# Altium project DAM16.PrjPcb
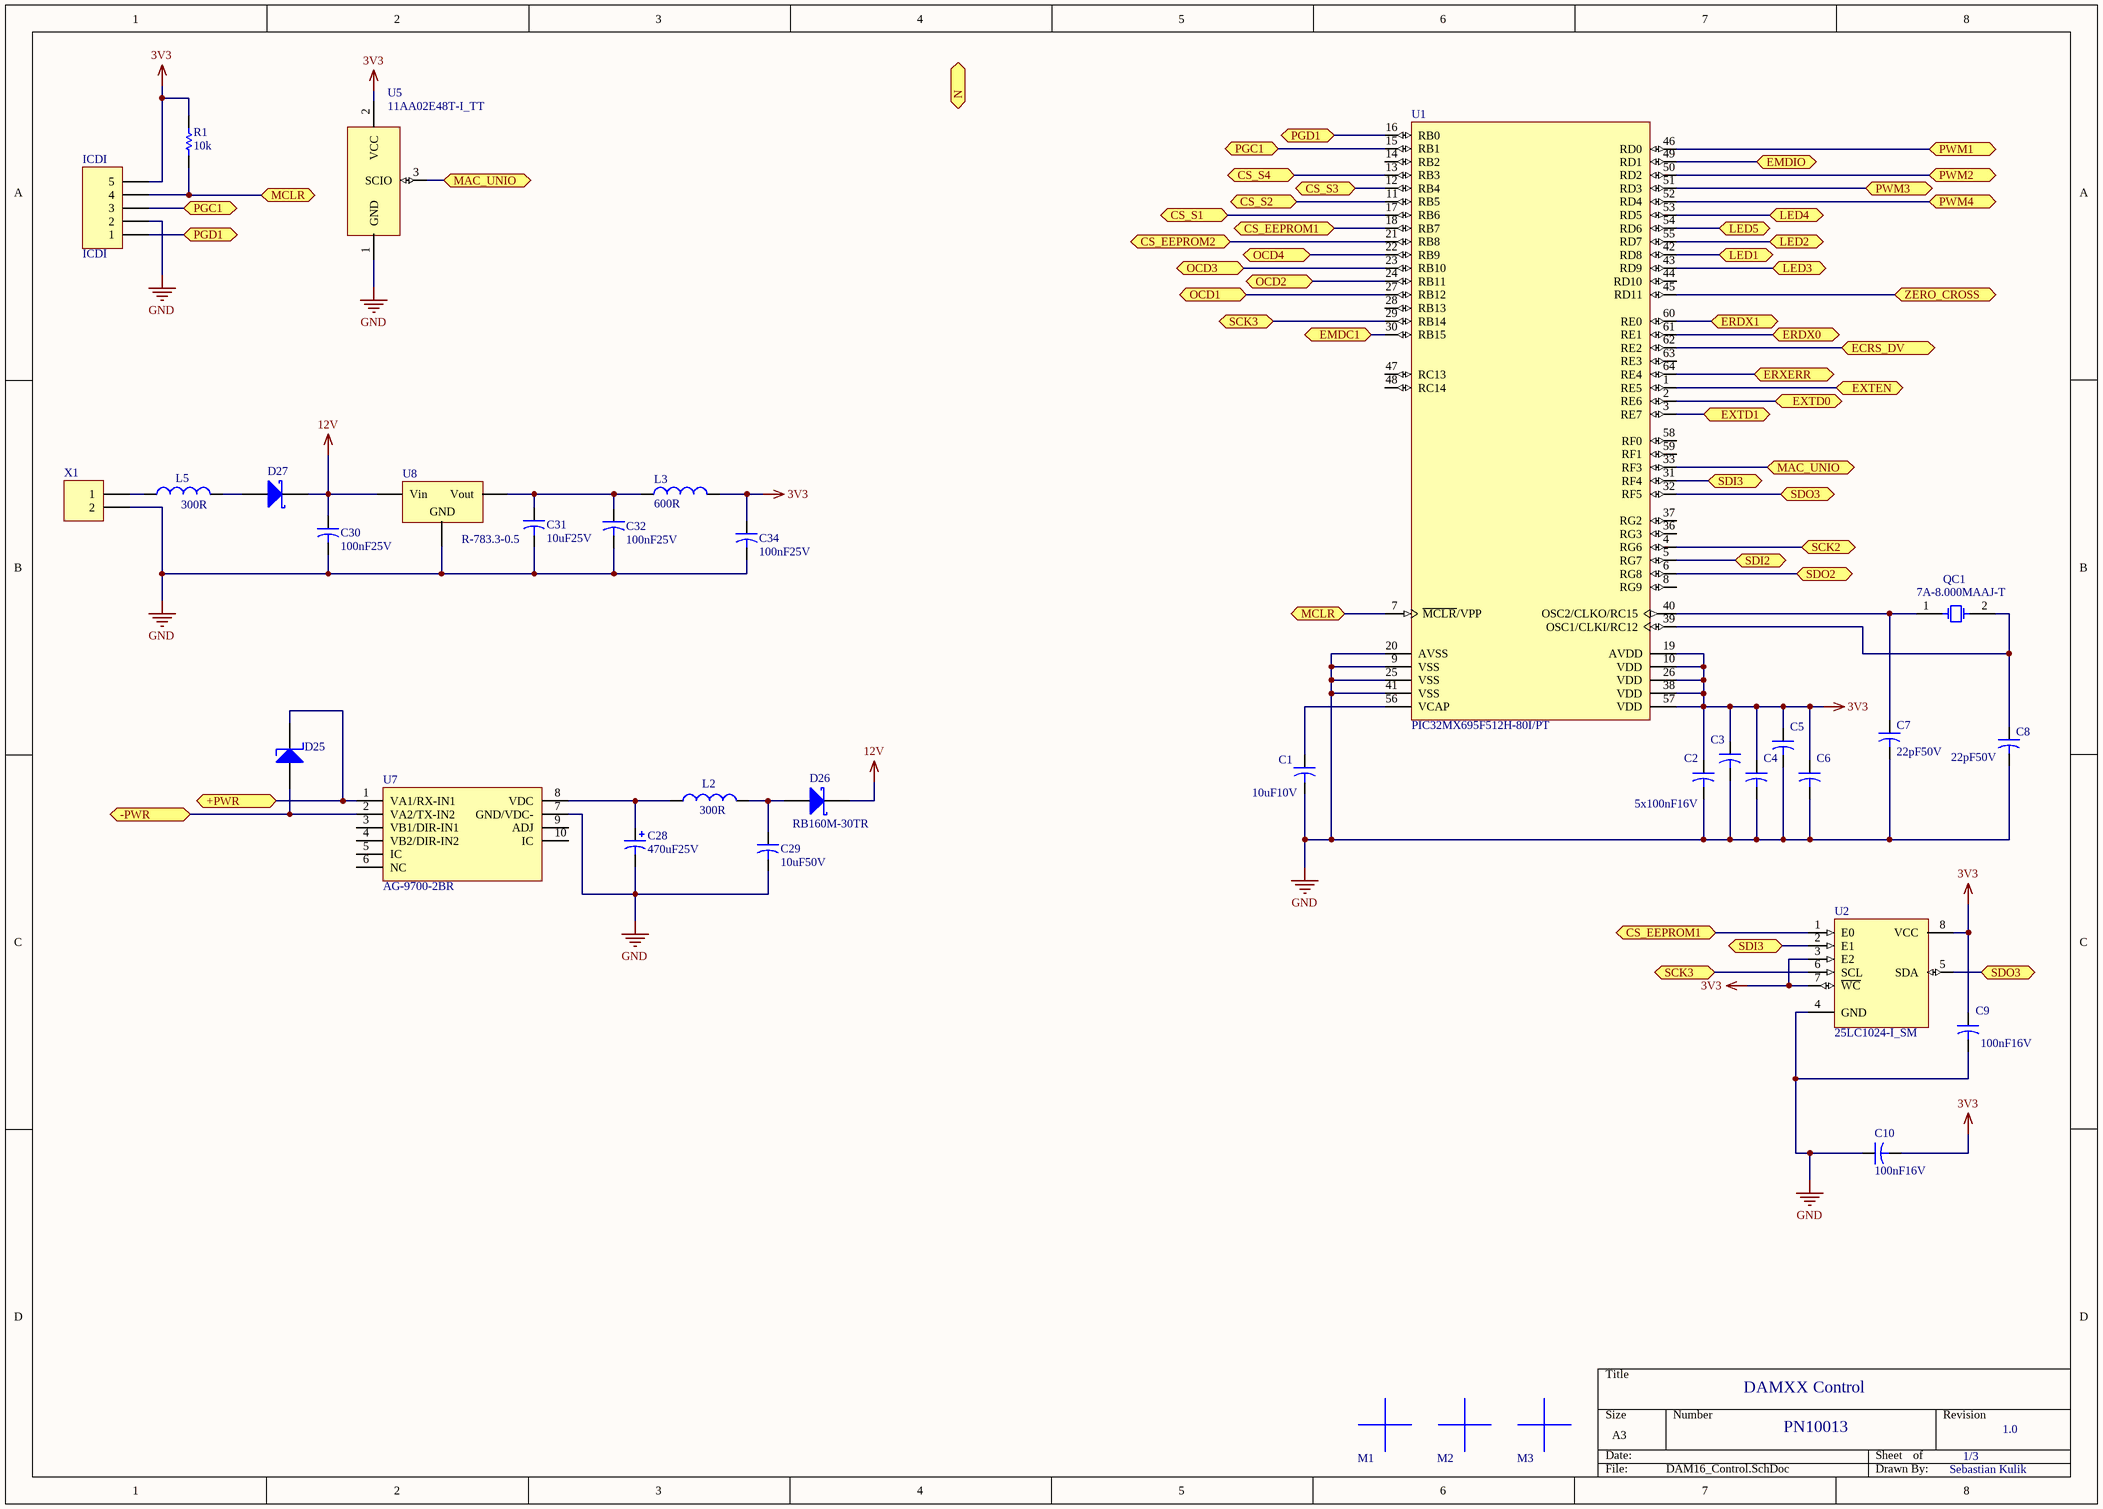
[diagram p0: DAM16_Control.SchDoc]
3 sheets, 96 parts. Net scope: flat (ports and power ports of the same name join across sheets).
Board file: DAM16.PcbDoc
Sheets:
  DAM16_Control.SchDoc
  DAM16_Ethernet.SchDoc
  DAM16_Relays.SchDoc

## Sheet DAM16_Control.SchDoc
size A3

### Parts
C1  value 10uF10V  [C0603]  (hidden comment: 10uF10V_0603)
C2  100nF16V_0402  [C0402]  (value not drawn)
C3  100nF16V_0402  [C0402]  (value not drawn)
C4  100nF16V_0402  [C0402]  (value not drawn)
C5  100nF16V_0402  [C0402]  (value not drawn)
C6  100nF16V_0402  [C0402]  (value not drawn)
C7  value 22pF50V  [C0402]  (hidden comment: 22pF50V_0402)
C8  value 22pF50V  [C0402]  (hidden comment: 22pF50V_0402)
C9  value 100nF16V  [C0402]  (hidden comment: 100nF16V_0402)
C10  value 100nF16V  [C0402]  (hidden comment: 100nF16V_0402)
C28  value 470uF25V  [Panasonic-H13]  (hidden comment: 470uF25V_POL)
C29  value 10uF50V  [C1210]  (hidden comment: 10uF50V_1210)
C30  value 100nF25V  [C0402]  (hidden comment: 100nF25V_0402)
C31  value 10uF25V  [C1210]  (hidden comment: 10uF25V_1210)
C32  value 100nF25V  [C0402]  (hidden comment: 100nF25V_0402)
C34  value 100nF25V  [C0402]  (hidden comment: 100nF25V_0402)
D25  SMAJ58A-E3/61  [DO214A]  (value not drawn)
D26  RB160M-30TR  [SOD123]
D27  SD103AW-V-GS08  [SOD123]  (value not drawn)
ICDI  ICDI  [HDR1X5-1.27]
L2  value 300R  [L0603]  (hidden comment: 300R2A_0603)
L3  value 600R  [P0402]  (hidden comment: 120R1.2A_0402)
L5  value 300R  [L0603]  (hidden comment: 10uF2A)
M1  Mark  [Mark-3mm]  (value not drawn)
M2  Mark  [Mark-3mm]  (value not drawn)
M3  Mark  [Mark-3mm]  (value not drawn)
QC1  7A-8.000MAAJ-T  [TXC_7A]
R1  value 10k  [R0402]  (hidden comment: 10k_0402)
U1  PIC32MX695F512H-80I/PT  [TQFP-64_N1]
U2  25LC1024-I_SM  [SOP8_N]
U5  11AA02E48T-I_TT  [SOT23_M]
U7  AG-9700-2BR  [Ag9700-2BR]
U8  R-783.3-0.5  [R-783_3-0_5]
X1  WR-TBL3127  [WR-TBL-3127]  (value not drawn)

### Ports
+PWR, -PWR, CS_EEPROM1, CS_EEPROM2, CS_S1, CS_S2, CS_S3, CS_S4, ECRS_DV, EMDC1, EMDIO, ERDX0, ERDX1, ERXERR, EXTD0, EXTD1, EXTEN, LED1, LED2, LED3, LED4, LED5, MAC_UNIO, MCLR, N, OCD1, OCD2, OCD3, OCD4, PGC1, PGD1, PWM1, PWM2, PWM3, PWM4, SCK2, SCK3, SDI2, SDI3, SDO2, SDO3, ZERO_CROSS

### Nets
3V3: C2.1 C3.1 C4.1 C5.1 C6.1 C9.1 C10.2 C34.1 ICDI.5 L3.2 R1.2 U1.10(VDD) U1.19(AVDD) U1.26(VDD) U1.38(VDD) U1.57(VDD) U2.3(E2) U2.7(~{WC}) U2.8(VCC) U5.2(VCC)
12V: C30.1 D26.1(K) D27.1(K) U8.1(Vin)
GND: C1.2 C2.2 C3.2 C4.2 C5.2 C6.2 C7.2 C8.2 C9.2 C10.1 C28.2 C29.2 C30.2 C31.2 C32.2 C34.2 ICDI.2 U1.9(VSS) U1.20(AVSS) U1.25(VSS) U1.41(VSS) U2.4(GND) U5.1(GND) U7.7(GND/VDC-) U8.2(GND) X1.2
NetC1_1: C1.1 U1.56(VCAP)
NetC7_1: C7.1 QC1.1(E/D) U1.40(OSC2/CLKO/RC15)
NetC8_1: C8.1 QC1.2(GND) U1.39(OSC1/CLKI/RC12)
NetC28_1: C28.1 L2.1 U7.8(VDC)
NetC29_1: C29.1 D26.2(A) L2.2
NetC31_1: C31.1 C32.1 L3.1 U8.3(Vout)
NetD25_1: D25.1(K) U7.1(VA1/RX-IN1) ; port +PWR
NetD25_2: D25.2(A) U7.2(VA2/TX-IN2) ; port -PWR
NetD27_2: D27.2(A) L5.2
NetICDI_1: ICDI.1 U1.16(RB0) ; port PGD1
NetICDI_3: ICDI.3 U1.15(RB1) ; port PGC1
NetICDI_4: ICDI.4 R1.1 U1.7(~{MCLR}/VPP) ; port MCLR
NetL5_1: L5.1 X1.1
NetR4_1: U1.49(RD1) ; port EMDIO
NetR5_1: U1.60(RE0) ; port ERDX1
NetR6_2: U1.61(RE1) ; port ERDX0
NetR7_2: U1.64(RE4) ; port ERXERR
NetR8_2: U1.62(RE2) ; port ECRS_DV
NetU1_1: U1.1(RE5) ; port EXTEN
NetU1_2: U1.2(RE6) ; port EXTD0
NetU1_3: U1.3(RE7) ; port EXTD1
NetU1_4: U1.4(RG6) ; port SCK2
NetU1_5: U1.5(RG7) ; port SDI2
NetU1_6: U1.6(RG8) ; port SDO2
NetU1_11: U1.11(RB5) ; port CS_S2
NetU1_12: U1.12(RB4) ; port CS_S3
NetU1_13: U1.13(RB3) ; port CS_S4
NetU1_17: U1.17(RB6) ; port CS_S1
NetU1_18: U1.18(RB7) U2.1(E0) ; port CS_EEPROM1
NetU1_21: U1.21(RB8) ; port CS_EEPROM2
NetU1_22: U1.22(RB9) ; port OCD4
NetU1_23: U1.23(RB10) ; port OCD3
NetU1_24: U1.24(RB11) ; port OCD2
NetU1_27: U1.27(RB12) ; port OCD1
NetU1_29: U1.29(RB14) U2.6(SCL) ; port SCK3
NetU1_30: U1.30(RB15) ; port EMDC1
NetU1_31: U1.31(RF4) U2.2(E1) ; port SDI3
NetU1_32: U1.32(RF5) U2.5(SDA) ; port SDO3
NetU1_33: U1.33(RF3) U5.3(SCIO) ; port MAC_UNIO
NetU1_42: U1.42(RD8) ; port LED1
NetU1_43: U1.43(RD9) ; port LED3
NetU1_45: U1.45(RD11) ; port ZERO_CROSS
NetU1_46: U1.46(RD0) ; port PWM1
NetU1_50: U1.50(RD2) ; port PWM2
NetU1_51: U1.51(RD3) ; port PWM3
NetU1_52: U1.52(RD4) ; port PWM4
NetU1_53: U1.53(RD5) ; port LED4
NetU1_54: U1.54(RD6) ; port LED5
NetU1_55: U1.55(RD7) ; port LED2

Not connected (* = marked no-connect by the designer): U1 8(RG9) 14(RB2) 28(RB13) 36(RG3) 37(RG2) 44(RD10) 47(RC13) 48(RC14) 58(RF0) 59(RF1) 63(RE3); U7 3(VB1/DIR-IN1) 4(VB2/DIR-IN2) 5(IC) 6(NC) 9(ADJ) 10(IC)

### Notes on the sheet
- (near C2) 5x100nF16V
- DAMXX Control
- PN10013
- 1/3
- 1.0
- Sebastian Kulik

### Library data of the parts
C1 = 10uF10V_0603: Capacitor; Part Description: AVX ,  X5R, 20%, 10V; Deliverer PartNr: 1867954RL; Manufacturer: AVX; Manufacturer PartNr: 0603ZD106MAT2A; Deliverer: Farnell; TDFE-PN: C0016; Published: 11.02.2014; Publisher: Sebastian Kulik; PackageDescription: C0603
C2-C6 C9 C10 = 100nF16V_0402: Capacitor; Part Description: TDK. CGA series, X7R, 10%, 16V; Deliverer PartNr: 2210748RL; Manufacturer: TDK; Manufacturer PartNr: CGA2B1X7R1C104K050BC; Deliverer: Farnell; TDFE-PN: C0025; Published: 12.02.2014; Publisher: Sebastian Kulik; PackageDescription: C0403
  C2-C6: Value: 100nF16V
C7 C8 = 22pF50V_0402: Murata, GRM series, 50V; Deliverer PartNr: 8819629RL; Manufacturer PartNr: GRM1555C1H220JZ01D; Deliverer: Farnell; TDFE-PN: C0021; Published: 11.02.2014; Part Description: Murata, GRM series, 50V; Publisher: Sebastian Kulik; PackageDescription: C0403; Manufacturer: Murata
C28 = 470uF25V_POL: Panasonic, TG series; Deliverer PartNr: 2282114; Manufacturer PartNr: EEV-TG1E471Q; Deliverer: Farnell; TDFE-PN: C0038; Published: 17.02.2014; Part Description: Panasonic, TG series; Publisher: Sebastian Kulik; Manufacturer: Panasonic
C29 = 10uF50V_1210: AVX,  X7R, 10%, 50V; Deliverer PartNr: 2094047RL; Manufacturer PartNr: 12105C106KAT2A; Deliverer: Farnell; TDFE-PN: C0039; Published: 17.02.2014; Part Description: AVX,  X7R, 10%, 50V; Publisher: Sebastian Kulik; PackageDescription: C1210; Manufacturer: AVX
C30 C32 C34 = 100nF25V_0402: AVX, X5R, 10%, 25V; Deliverer PartNr: 2280767; Manufacturer PartNr: 04023D104KAT2A; Deliverer: Farnell; TDFE-PN: C0036; Published: 13.02.2014; Part Description: AVX, X5R, 10%, 25V; Publisher: Sebastian Kulik; PackageDescription: C0403; Manufacturer: AVX
C31 = 10uF25V_1210: Capacitor; Part Description: TDK  C series, X5R, 10%, 25V; Deliverer PartNr: 2346957; Manufacturer: TDK; Manufacturer PartNr: C3225X5R1E106K250AA; Deliverer: Farnell; TDFE-PN: C0014; Published: 12.02.2014; Publisher: Sebastian Kulik; PackageDescription: C1210
D25 = SMAJ58A-E3/61: TVS, 400W, 58V; Deliverer PartNr: 1837053; Manufacturer: Vishay; TDE-PN: DIS0009; Deliverer: Farnell; Published: 17.02.2014; PackageReference: DO214AC; Publisher: Sebastian Kulik; PackageDescription: DO214AC; Manufacturer PartNr: SMAJ58A-E3/61
D26 = RB160M-30TR: Diode Schottky,2A,40V; Deliverer PartNr: 1525480; Manufacturer: Rohm; TDE-PN: DIS0010; Deliverer: Farnell; Published: 17.02.2014; PackageReference: SOD123; Publisher: Sebastian Kulik; PackageDescription: SOD123; Manufacturer PartNr: RB160M-30TR
D27 = SD103AW-V-GS08: Diode Schottky,2A,40V; Deliverer PartNr: 1617720RL; Manufacturer: Vishay; TDE-PN: DIS0008; Deliverer: Farnell; Published: 12.02.2014; PackageReference: TO-220AC; Publisher: Sebastian Kulik; PackageDescription: SOD123; Manufacturer PartNr: SD103AW-V-GS08
ICDI = ICDI: Header, 5-Pin; LatestRevisionDate: 17-Jul-2002; LatestRevisionNote: Re-released for DXP Platform.; Publisher: Sebastian Kulik
L2 L5 = 300R2A_0603: WE, Ferrit, 300Rx2A; Deliverer PartNr: 1635705; Manufacturer PartNr: 742792641; Deliverer: Farnell; TDE-PN: P0021; Manufacturer: WE; Published: 26.05.2014; Publisher: Sebastian Kulik
L3 = 120R1.2A_0402: Ferrit, 1.2A, 120R@100MHz; Deliverer PartNr: 1961699RL; Manufacturer: WE; Manufacturer PartNr: 7427927311; Deliverer: Farnell; TDE-PN: P0022; Published: 26.05.2014; Publisher: Sebastian Kulik
QC1 = Crystal_8MHz: Crystal, 7A-8.000MAAJ-T; Deliverer PartNr: 1892148; Manufacturer: TXC; Deliverer: Farnell; TDE-PN: P0003; Published: 14.02.2014; PackageReference: 7A; Publisher: Sebastian Kulik; Manufacturer PartNr: 7A-8.000MAAJ-T
R1 = 10k_0402: Vishay CRCW series, 125mW, 1%; Manufacturer PartNr: CRCW040210K0FKEAHP; Deliverer PartNr: 1738864; TDE-PN: R0012; Deliverer: Farnell; Published: 12.02.2014; PackageReference: 0402; Publisher: Sebastian Kulik; PackageDescription: 0402; Manufacturer: Vishay; Part Description: Vishay CRCW series, 125mW, 1%
U1 = PIC32MX695F512H-80I/PT: High Performance ROM-less Microcontroller with External Memory Bus, 1.5K RAM, 64-Pin TQFP, 4.2 to 5.5V Supply Range, Industrial Temperature; Deliverer PartNr: 1778975; Manufacturer: Microchip; Deliverer: Farnell; TDE-PN: IC0031; Published: 11.02.2014; PackageReference: TQFP-64; Publisher: Sebastian Kulik; PackageDescription: 64-Pin Thin Plastic Quad Flat Pack 0.5 mm Pitch, 1.0/0.1 mm Lead Form; Manufacturer PartNr: PIC32MX695F512H-80I/PT
U2 = 25LC1024-I_SM: 1024 Kbit Serial SPI Bus EEPROM; Deliverer PartNr: 1331393; Manufacturer: Microchip; Deliverer: Farnell; TDE-PN: IC0033; Published: 12.02.2014; PackageReference: SOP8; Publisher: Sebastian Kulik; Manufacturer PartNr: 25LC1024-I_SM
U5 = 11AA02E48T-I_TT: 2 kbit Serial  EEPROM; Deliverer PartNr: 1707616RL; Manufacturer PartNr: 11AA02E48T-I/TT; Manufacturer: Microchip; Deliverer: Farnell; TDE-PN: IC0035; Published: 12.02.2014; PackageReference: SOT23; Publisher: Sebastian Kulik
U7 = AG-9700-2BR: PoE, 12V, 12W; Manufacturer: Silvertel; TDE-PN: IC0047; Published: 23.05.2014; Deliverer PartNr: -; Deliverer: -; PackageReference: TSSOP8; Publisher: Sebastian Kulik; Manufacturer PartNr: AG-9700-2BR
U8 = Recom-R-783_3-0_5: Voltage Regulator; Manufacturer: Recom; Deliverer PartNr: 532-8044; TDE-PN: IC0032; Deliverer: RS-Components; Published: 12.02.2014; Manufacturer PartNr: R-783.3-0.5; PackageReference: D2PAK; Publisher: Sebastian Kulik
X1 = Header-2-WR-TBL3127: Header 2 pin, horizontal,WR-TBL3127; Manufacrurer PartNr: 691312710002; Manufacturer: WE; Deliverer PartNr: 1841288; Deliverer: Farnell; TDE-PN: CON0014; LatestRevisionDate: 28.05.2014; LatestRevisionNote: Re-released for DXP Platform.; Publisher: Sebastian Kulik

## Sheet DAM16_Ethernet.SchDoc
size A3
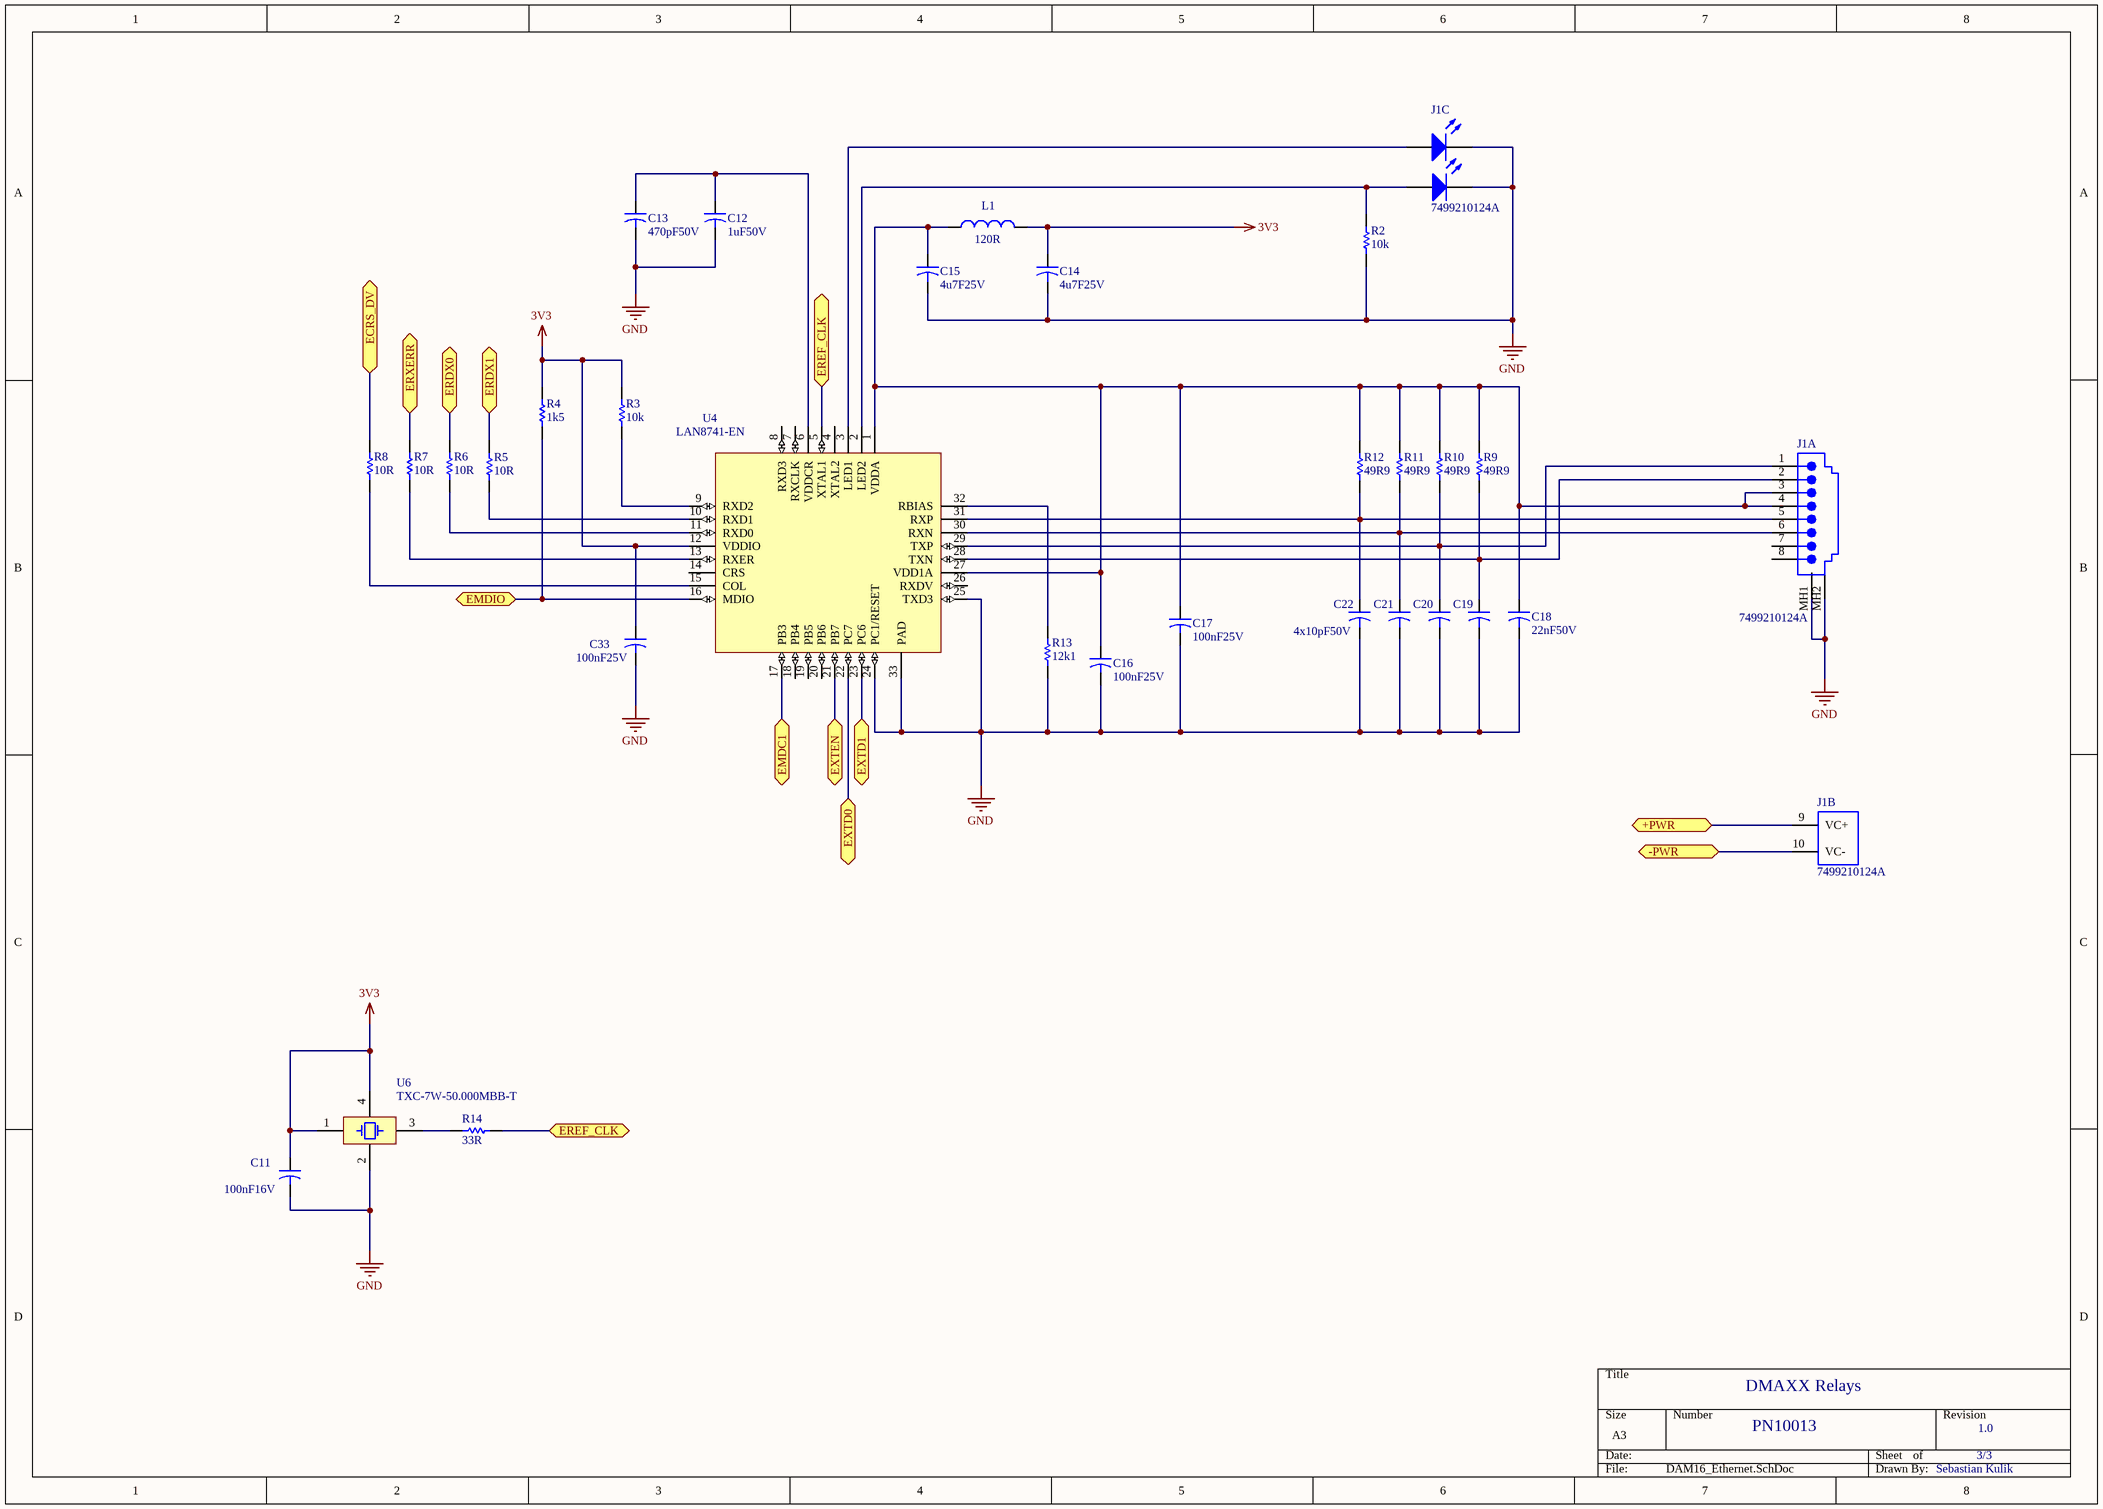
[diagram p1: DAM16_Ethernet.SchDoc]

### Parts
C11  value 100nF16V  [C0402]  (hidden comment: 100nF16V_0402)
C12  value 1uF50V  [C0603]  (hidden comment: 1uF50V_0603)
C13  value 470pF50V  [C0402]  (hidden comment: 470pF50V_0402)
C14  value 4u7F25V  [C0805]  (hidden comment: 4u7F25V_0805)
C15  value 4u7F25V  [C0805]  (hidden comment: 4u7F25V_0805)
C16  value 100nF25V  [C0402]  (hidden comment: 100nF25V_0402)
C17  value 100nF25V  [C0402]  (hidden comment: 100nF25V_0402)
C18  value 22nF50V  [C0603]  (hidden comment: 22nF50V_0603)
C19  10pF50V_0603  [C0603]  (value not drawn)
C20  10pF50V_0603  [C0603]  (value not drawn)
C21  10pF50V_0603  [C0603]  (value not drawn)
C22  10pF50V_0603  [C0603]  (value not drawn)
C33  value 100nF25V  [C0402]  (hidden comment: 100nF25V_0402)
J1  7499210124A  [7499210124A]  (parts A,B,C of 3)
L1  value 120R  [L0603]  (hidden comment: 120R4A_0603)
R2  value 10k  [R0402]  (hidden comment: 10k_0402)
R3  value 10k  [R0402]  (hidden comment: 10k_0402)
R4  value 1k5  [R0402]  (hidden comment: 1k5_0402)
R5  value 10R  [R0402]  (hidden comment: 10R_0402)
R6  value 10R  [R0402]  (hidden comment: 10R_0402)
R7  value 10R  [R0402]  (hidden comment: 10R_0402)
R8  value 10R  [R0402]  (hidden comment: 10R_0402)
R9  value 49R9  [R0402]  (hidden comment: 49R9_0402)
R10  value 49R9  [R0402]  (hidden comment: 49R9_0402)
R11  value 49R9  [R0402]  (hidden comment: 49R9_0402)
R12  value 49R9  [R0402]  (hidden comment: 49R9_0402)
R13  value 12k1  [R0603(1608)]  (hidden comment: 12k1_0603)
R14  value 33R  [R0402]  (hidden comment: 33R_0402)
U4  LAN8741-EN  [32M1-A_M]
U6  TXC-7W-50.000MBB-T  [TXC_7W]

### Ports
+PWR, -PWR, ECRS_DV, EMDC1, EMDIO, ERDX0, ERDX1, EREF_CLK, ERXERR, EXTD0, EXTD1, EXTEN

### Nets
3V3: C11.1 C14.1 C33.1 L1.2 R3.2 R4.2 U4.12(VDDIO) U6.1(E/D) U6.4(VCC)
GND: C11.2 C12.2 C13.2 C14.2 C15.2 C16.2 C17.2 C18.2 C19.2 C20.2 C21.2 C22.2 C33.2 J1.11(K) J1.13(K) J1.MH1(Shield) J1.MH2(Shield) R2.1 R13.1 U4.24(PC1/RESET) U4.25(TXD3) U4.33(PAD) U6.2(GND)
NetC12_1: C12.1 C13.1 U4.6(VDDCR)
NetC15_1: C15.1 C16.1 C17.1 C18.1 J1.3 J1.4 L1.1 R9.2 R10.2 R11.2 R12.2 U4.1(VDDA) U4.27(VDD1A)
NetC19_1: C19.1 J1.2 R9.1 U4.28(TXN)
NetC20_1: C20.1 J1.1 R10.1 U4.29(TXP)
NetC21_1: C21.1 J1.6 R11.1 U4.30(RXN)
NetC22_1: C22.1 J1.5 R12.1 U4.31(RXP)
NetD25_1: J1.9(VC+) ; port +PWR
NetD25_2: J1.10(VC-) ; port -PWR
NetJ1_12: J1.12(A) U4.3(LED1)
NetJ1_14: J1.14(A) R2.2 U4.2(LED2)
NetR3_1: R3.1 U4.9(RXD2)
NetR4_1: R4.1 U4.16(MDIO) ; port EMDIO
NetR5_1: R5.1 ; port ERDX1
NetR5_2: R5.2 U4.10(RXD1)
NetR6_1: R6.1 U4.11(RXD0)
NetR6_2: R6.2 ; port ERDX0
NetR7_1: R7.1 U4.13(RXER)
NetR7_2: R7.2 ; port ERXERR
NetR8_1: R8.1 U4.15(COL)
NetR8_2: R8.2 ; port ECRS_DV
NetR13_2: R13.2 U4.32(RBIAS)
NetR14_1: R14.1 U6.3(OSC2)
NetR14_2: R14.2 U4.5(XTAL1) ; port EREF_CLK
NetU1_1: U4.21(PB7) ; port EXTEN
NetU1_2: U4.22(PC7) ; port EXTD0
NetU1_3: U4.23(PC6) ; port EXTD1
NetU1_30: U4.17(PB3) ; port EMDC1

Not connected (* = marked no-connect by the designer): J1 7 8; U4 4(XTAL2) 7(RXCLK) 8(RXD3) 14(CRS) 18(PB4) 19(PB5) 20(PB6) 26(RXDV)

### Notes on the sheet
- (near C22) 4x10pF50V
- DMAXX Relays
- PN10013
- 3/3
- 1.0
- Sebastian Kulik

### Library data of the parts
C11 = 100nF16V_0402: as C2 on sheet DAM16_Control; Published: 12.02.2014; Publisher: Sebastian Kulik; PackageDescription: C0403
C12 = 1uF50V_0603: C series, X5R, 10%; Deliverer PartNr: 2211179RL; Manufacturer: TDK; Manufacturer PartNr: C1608X5R1H105K080AB; Deliverer: Farnell; TDFE-PN: C0037; Published: 13.02.2014; Part Description: C series, X5R, 10%; Publisher: Sebastian Kulik; PackageDescription: C0603
C13 = 470pF50V_0402: AVX, 50V; Deliverer PartNr: 1657927; Manufacturer PartNr: 04025A471JAT2A; Deliverer: Farnell; TDFE-PN: C0030; Published: 13.02.2014; Part Description: AVX,50V; Publisher: Sebastian Kulik; PackageDescription: C0403; Manufacturer: AVX
C14 C15 = 4u7F25V_0805: TDK  C series, X7R, 10%, 25V; Deliverer PartNr: 2346943RL; Manufacturer PartNr: C2012X7R1E475K125AB; Deliverer: Farnell; TDFE-PN: C0035; Published: 13.02.2014; Part Description: TDK  C series, X7R, 10%, 25V; Publisher: Sebastian Kulik; PackageDescription: C0805; Manufacturer: TDK
C16 C17 C33 = 100nF25V_0402: as C30 on sheet DAM16_Control; Published: 13.02.2014; Part Description: AVX, X5R, 10%, 25V; Publisher: Sebastian Kulik; PackageDescription: C0403; Manufacturer: AVX
C18 = 22nF50V_0603: AVX ,  X7R, 5%, 50V; Deliverer PartNr: 2332645RL; Manufacturer PartNr: 06035C223JAT2A; Deliverer: Farnell; TDFE-PN: C0034; Published: 13.02.2014; Part Description: AVX ,  X7R, 5%, 50V; Publisher: Sebastian Kulik; PackageDescription: C0603; Manufacturer: AVX
C19-C22 = 10pF50V_0603: AVX ,  +-0.5pF, 50V; Deliverer PartNr: 2332595RL; Manufacturer PartNr: 06035A100DAT2A; Deliverer: Farnell; TDFE-PN: C0033; Published: 13.02.2014; Part Description: AVX ,  +-0.5pF, 50V; Publisher: Sebastian Kulik; PackageDescription: C0603; Manufacturer: AVX; Value: 10pF50V
J1 = Ethernet, POE, WE7499210124A: Modular Jack , Right Angle RJ-45, Low Profile; Deliverer PartNr: 2356103; Manufacturer: Wuerth Elektronik; Ports: 1; PCB_Mounting: Thru-Hole; Deliverer: Farnell; TDE-PN: CON0013; PackageReference: 7499210124A; Publisher: Sebastian Kulik; Manufacturer PartNr: 7499210124A
L1 = 120R4A_0603: Murata, Ferrit, 120Rx2A; Deliverer PartNr: 1515738RL; Manufacturer PartNr: BLM18PG121SN1D; Deliverer: Farnell; TDE-PN: P0016; Manufacturer: Murata; Published: 13.02.2014; Publisher: Sebastian Kulik
R2 R3 = 10k_0402: as R1 on sheet DAM16_Control; Published: 12.02.2014; PackageReference: 0402; Publisher: Sebastian Kulik; PackageDescription: 0402; Manufacturer: Vishay; Part Description: Vishay CRCW series, 125mW, 1%
R4 = 1k5_0402: Vishay CRCW series, 125mW, 1%; Manufacturer PartNr: CRCW04021K50FKEAHP; Deliverer PartNr: 1738852; Part Description: Vishay CRCW series, 63mW, 1%; TDE-PN: R0036; Deliverer: Farnell; Published: 13.02.2014; PackageReference: 0402; Publisher: Sebastian Kulik; PackageDescription: 0402; Manufacturer: Vishay
R5-R8 = 10R_0402: Vishay CRCW series, 125mW, 1%; Manufacturer PartNr: CRCW040210R0FKEAHP; Deliverer PartNr: 1738824RL; TDE-PN: R0015; Deliverer: Farnell; Published: 12.02.2014; PackageReference: 0402; Publisher: Sebastian Kulik; PackageDescription: 0402; Manufacturer: Vishay; Part Description: Vishay CRCW series, 125mW, 1%
R9-R12 = 49R9_0402: Vishay CRCW series, 63mW, 1%; Manufacturer PartNr: CRCW040249R9FKED; Deliverer PartNr: 2121437; TDE-PN: R0035; Deliverer: Farnell; Published: 13.02.2014; PackageReference: 0402; Publisher: Sebastian Kulik; PackageDescription: 0402; Manufacturer: Vishay; Part Description: Vishay CRCW series, 63mW, 1%
R13 = 12k1_0603: Vishay, CRCW series, 100mW, 1%; Manufacturer PartNr: CRCW060312K1FKEA; Deliverer PartNr: 2122502; TDE-PN: R0037; Deliverer: Farnell; Published: 11.02.2014; Publisher: Sebastian Kulik; PackageDescription: 0603; Manufacturer: Vishay; Part Desicription: Vishay, CRCW series, 100mW, 1%
R14 = 33R_0402: Vishay CRCW series, 63mW, 1%; Manufacturer PartNr: CRCW040233R0FKEAHP; Deliverer PartNr: 1738830; TDE-PN: R0037; Deliverer: Farnell; Published: 12.02.2014; PackageReference: 0402; Publisher: Sebastian Kulik; PackageDescription: 0402; Manufacturer: Vishay; Part Description: Vishay CRCW series, 63mW, 1%
U4 = LAN8741-EN: Ethernet Phy; Deliverer PartNr: 2373284; Manufacturer PartNr: LAN8741A-EN; Manufacturer: Microchip; TDE-PN: IC0036; Deliverer: Farnell; Published: 12.02.2014; LatestRevisionNote: IPC-7351 Footprint Added.; Publisher: Sebastian Kulik
U6 = TXC-7W-50.000MBB-T: Crystal; Deliverer PartNr: 1842144; Manufacturer: TXC; Deliverer: Farnell; TDE-PN: IC0037; Published: 17.02.2014; PackageReference: SOT23; Publisher: Sebastian Kulik; Manufacturer PartNr: 7W-50.000MBB-T

## Sheet DAM16_Relays.SchDoc
size A3
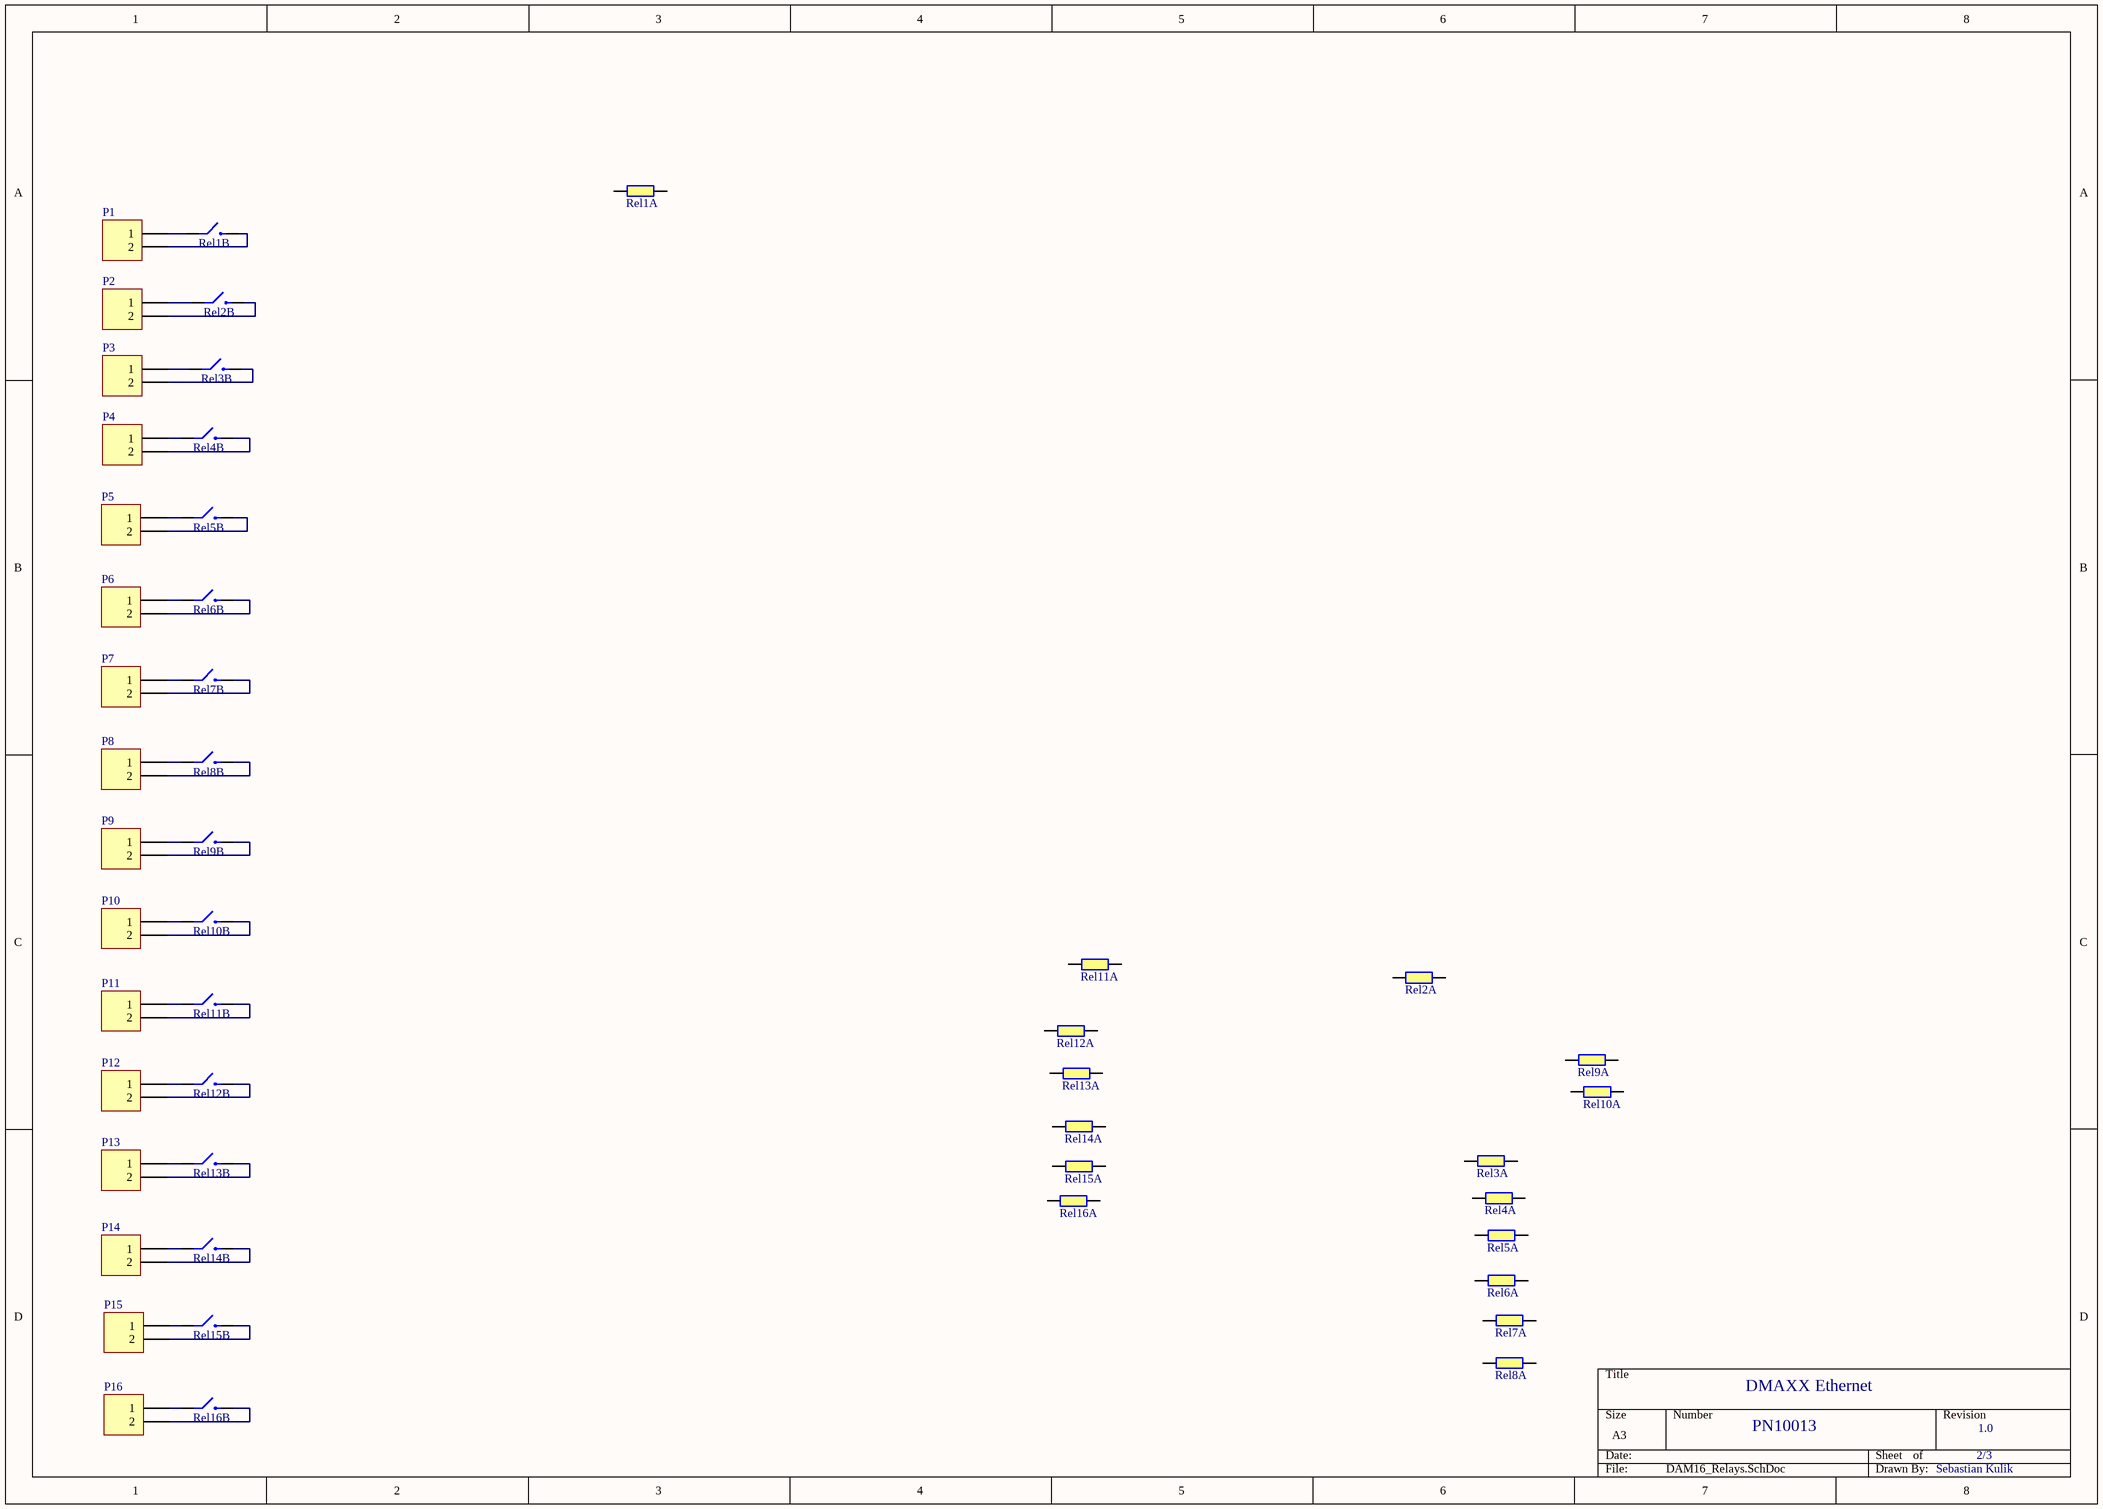
[diagram p2: DAM16_Relays.SchDoc]

### Parts
P1  PHOENIX_1715721  [Phoenix-2-5_08]  (value not drawn)
P2  PHOENIX_1715721  [Phoenix-2-5_08]  (value not drawn)
P3  PHOENIX_1715721  [Phoenix-2-5_08]  (value not drawn)
P4  PHOENIX_1715721  [Phoenix-2-5_08]  (value not drawn)
P5  PHOENIX_1715721  [Phoenix-2-5_08]  (value not drawn)
P6  PHOENIX_1715721  [Phoenix-2-5_08]  (value not drawn)
P7  PHOENIX_1715721  [Phoenix-2-5_08]  (value not drawn)
P8  PHOENIX_1715721  [Phoenix-2-5_08]  (value not drawn)
P9  PHOENIX_1715721  [Phoenix-2-5_08]  (value not drawn)
P10  PHOENIX_1715721  [Phoenix-2-5_08]  (value not drawn)
P11  PHOENIX_1715721  [Phoenix-2-5_08]  (value not drawn)
P12  PHOENIX_1715721  [Phoenix-2-5_08]  (value not drawn)
P13  PHOENIX_1715721  [Phoenix-2-5_08]  (value not drawn)
P14  PHOENIX_1715721  [Phoenix-2-5_08]  (value not drawn)
P15  PHOENIX_1715721  [Phoenix-2-5_08]  (value not drawn)
P16  PHOENIX_1715721  [Phoenix-2-5_08]  (value not drawn)
Rel1  Omron_G5RL-1A-E-HR  [Omron-G5RL-HR]  (value not drawn)  (parts A,B of 2)
Rel2  Omron_G5RL-1A-E-HR  [Omron-G5RL-HR]  (value not drawn)  (parts A,B of 2)
Rel3  Omron_G5RL-1A-E-HR  [Omron-G5RL-HR]  (value not drawn)  (parts A,B of 2)
Rel4  Omron_G5RL-1A-E-HR  [Omron-G5RL-HR]  (value not drawn)  (parts A,B of 2)
Rel5  Omron_G5RL-1A-E-HR  [Omron-G5RL-HR]  (value not drawn)  (parts A,B of 2)
Rel6  Omron_G5RL-1A-E-HR  [Omron-G5RL-HR]  (value not drawn)  (parts A,B of 2)
Rel7  Omron_G5RL-1A-E-HR  [Omron-G5RL-HR]  (value not drawn)  (parts A,B of 2)
Rel8  Omron_G5RL-1A-E-HR  [Omron-G5RL-HR]  (value not drawn)  (parts A,B of 2)
Rel9  Omron_G5RL-1A-E-HR  [Omron-G5RL-HR]  (value not drawn)  (parts A,B of 2)
Rel10  Omron_G5RL-1A-E-HR  [Omron-G5RL-HR]  (value not drawn)  (parts A,B of 2)
Rel11  Omron_G5RL-1A-E-HR  [Omron-G5RL-HR]  (value not drawn)  (parts A,B of 2)
Rel12  Omron_G5RL-1A-E-HR  [Omron-G5RL-HR]  (value not drawn)  (parts A,B of 2)
Rel13  Omron_G5RL-1A-E-HR  [Omron-G5RL-HR]  (value not drawn)  (parts A,B of 2)
Rel14  Omron_G5RL-1A-E-HR  [Omron-G5RL-HR]  (value not drawn)  (parts A,B of 2)
Rel15  Omron_G5RL-1A-E-HR  [Omron-G5RL-HR]  (value not drawn)  (parts A,B of 2)
Rel16  Omron_G5RL-1A-E-HR  [Omron-G5RL-HR]  (value not drawn)  (parts A,B of 2)

### Nets
NetP1_1: P1.1 Rel1.3
NetP1_2: P1.2 Rel1.4
NetP2_1: P2.1 Rel2.3
NetP2_2: P2.2 Rel2.4
NetP3_1: P3.1 Rel3.3
NetP3_2: P3.2 Rel3.4
NetP4_1: P4.1 Rel4.3
NetP4_2: P4.2 Rel4.4
NetP5_1: P5.1 Rel5.3
NetP5_2: P5.2 Rel5.4
NetP6_1: P6.1 Rel6.3
NetP6_2: P6.2 Rel6.4
NetP7_1: P7.1 Rel7.3
NetP7_2: P7.2 Rel7.4
NetP8_1: P8.1 Rel8.3
NetP8_2: P8.2 Rel8.4
NetP9_1: P9.1 Rel9.3
NetP9_2: P9.2 Rel9.4
NetP10_1: P10.1 Rel10.3
NetP10_2: P10.2 Rel10.4
NetP11_1: P11.1 Rel11.3
NetP11_2: P11.2 Rel11.4
NetP12_1: P12.1 Rel12.3
NetP12_2: P12.2 Rel12.4
NetP13_1: P13.1 Rel13.3
NetP13_2: P13.2 Rel13.4
NetP14_1: P14.1 Rel14.3
NetP14_2: P14.2 Rel14.4
NetP15_1: P15.1 Rel15.3
NetP15_2: P15.2 Rel15.4
NetP16_1: P16.1 Rel16.3
NetP16_2: P16.2 Rel16.4

Not connected (* = marked no-connect by the designer): Rel1 1 2; Rel2 1 2; Rel3 1 2; Rel4 1 2; Rel5 1 2; Rel6 1 2; Rel7 1 2; Rel8 1 2; Rel9 1 2; Rel10 1 2; Rel11 1 2; Rel12 1 2; Rel13 1 2; Rel14 1 2; Rel15 1 2; Rel16 1 2

### Notes on the sheet
- DMAXX Ethernet
- PN10013
- 2/3
- 1.0
- Sebastian Kulik

### Library data of the parts
P1-P16 = 2Pol_1715721: Phoenix, 2 pol, 5.08mm, 22A, 715721; Deliverer PartNr: 3041529; Deliverer: Farnell; TDE-PN: CON0008; LatestRevisionDate: 02.05.2014; LatestRevisionNote: Re-released for DXP Platform.; Publisher: Sebastian Kulik; Manufacturer PartNr: 1715721; Manufacturer: Phoenix
Rel1-Rel16 = Omron_G5RL-1A-E-HR: Omron_G5RL-1A-E-HR, 16A, 12V, 400mW; Deliverer PartNr: 2213807; Manufacturer PartNr: G5RL1AEHR12DC; Manufacturer: Finder; Deliverer: Farnell; TDE-PN: M0005; Published: 10.06.2014; PackageReference: Finder-43 series; Publisher: Sebastian Kulik

## Nets that join several sheets
3V3: DAM16_Control (20 pins), DAM16_Ethernet (9 pins)
GND: DAM16_Control (26 pins), DAM16_Ethernet (23 pins)
NetD25_1: DAM16_Control (D25.1 U7.1), DAM16_Ethernet (J1.9)
NetD25_2: DAM16_Control (D25.2 U7.2), DAM16_Ethernet (J1.10)
NetR4_1: DAM16_Control (U1.49), DAM16_Ethernet (R4.1 U4.16)
NetR5_1: DAM16_Control (U1.60), DAM16_Ethernet (R5.1)
NetR6_2: DAM16_Control (U1.61), DAM16_Ethernet (R6.2)
NetR7_2: DAM16_Control (U1.64), DAM16_Ethernet (R7.2)
NetR8_2: DAM16_Control (U1.62), DAM16_Ethernet (R8.2)
NetU1_1: DAM16_Control (U1.1), DAM16_Ethernet (U4.21)
NetU1_2: DAM16_Control (U1.2), DAM16_Ethernet (U4.22)
NetU1_3: DAM16_Control (U1.3), DAM16_Ethernet (U4.23)
NetU1_30: DAM16_Control (U1.30), DAM16_Ethernet (U4.17)